# Altium schematic sheet MCU.SchDoc
size A3; SheetNumber: 3; SheetTotal: 6
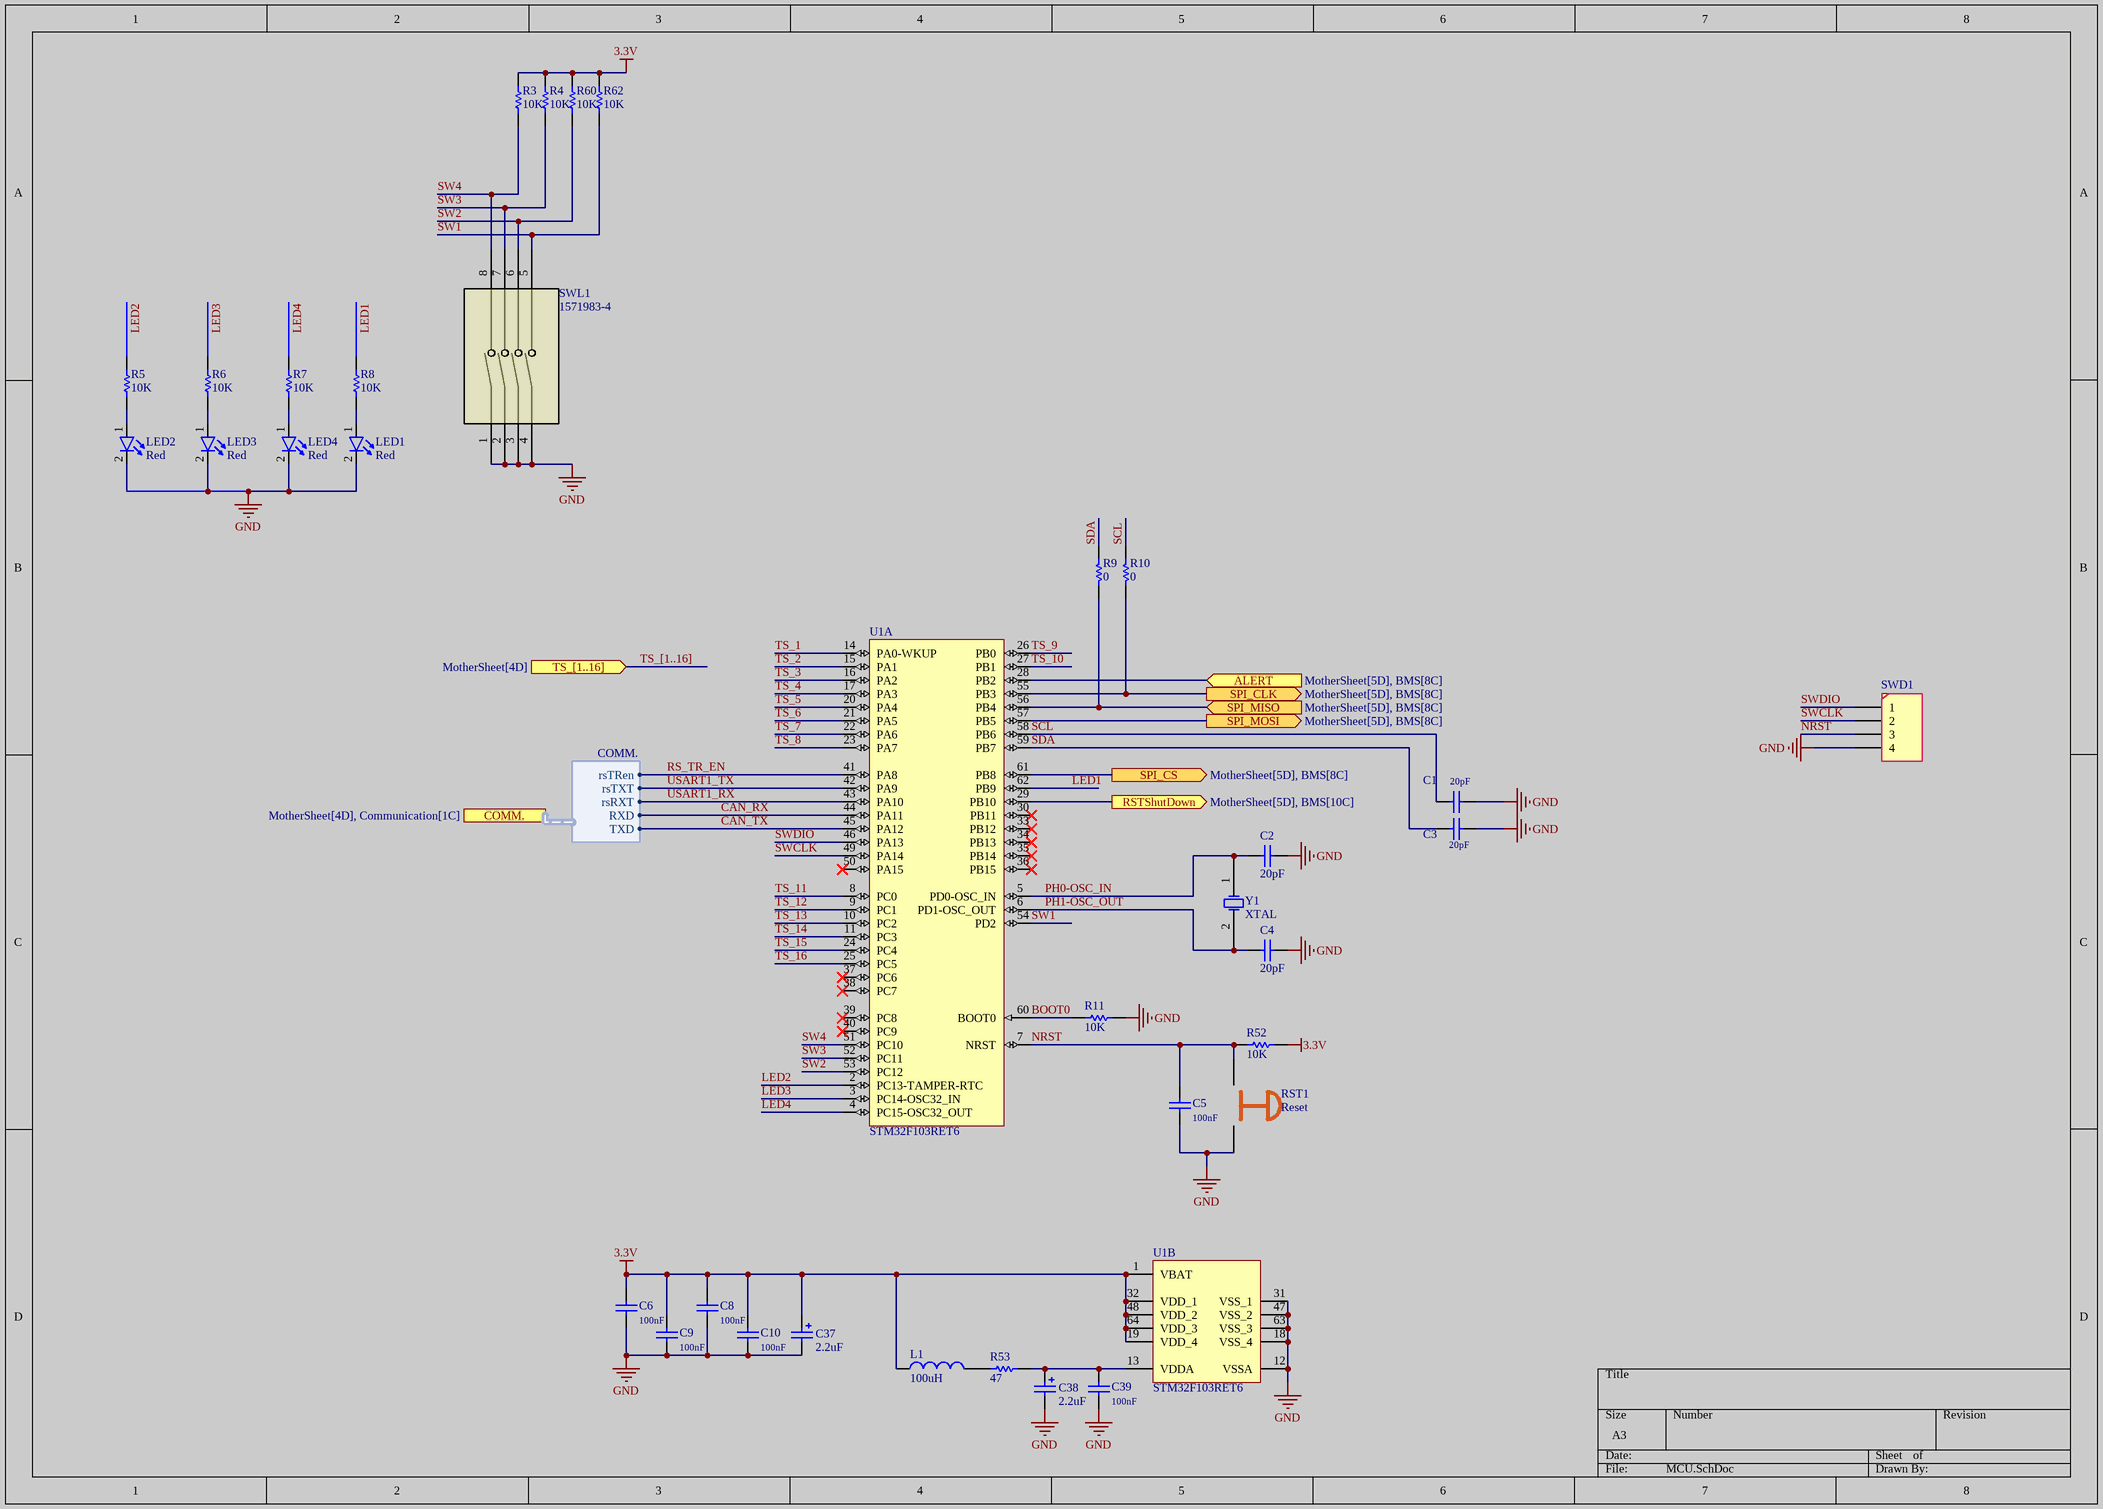
[diagram p0: MCU.SchDoc]

## Parts
C1  20pF  [CAPC0603]
C2  20pF  [CAPC0603]
C3  20pF  [CAPC0603]
C4  20pF  [CAPC0603]
C5  100nF  [CAPC0603]
C6  100nF  [CAPC0603]
C8  100nF  [CAPC0603]
C9  100nF  [CAPC0603]
C10  100nF  [CAPC0603]
C37  2.2uF  [CAP1206]
C38  2.2uF  [CAP1206]
C39  100nF  [CAPC0603]
L1  100uH  [RES1206]
LED1  Red  [LED]
LED2  Red  [LED]
LED3  Red  [LED]
LED4  Red  [LED]
R3  10K  [RES0603]
R4  10K  [RES0603]
R5  10K  [RESC0603]
R6  10K  [RESC0603]
R7  10K  [RESC0603]
R8  10K  [RESC0603]
R9  0  [RESC0603]
R10  0  [RESC0603]
R11  10K  [RESC0603]
R52  10K  [RESC0603]
R53  47  [RESC0603]
R60  10K  [RES0603]
R62  10K  [RES0603]
RST1  Reset  [SWITCH-PB4]
SWD1  (no value)  [PIN HEADER 1*4 MALE]
SWL1  1571983-4  [SW4_1571983_4P_TEC]
U1  STM32F103RET6  [LQFP, 64]  (parts A,B of 2)
Y1  XTAL  [XTAL]

## Ports
ALERT (in, see MotherSheet[5D], BMS[8C]), COMM. (harness COMM., see MotherSheet[4D], Communication[1C]), RSTShutDown (out, see MotherSheet[5D], BMS[10C]), SPI_CLK (out, see MotherSheet[5D], BMS[8C]), SPI_CS (out, see MotherSheet[5D], BMS[8C]), SPI_MISO (in, see MotherSheet[5D], BMS[8C]), SPI_MOSI (out, see MotherSheet[5D], BMS[8C]), TS_[1..16] (in, see MotherSheet[4D])

## Harnesses
COMM.: RXD, TXD, rsRXT, rsTXT, rsTRen

## Nets
3.3V: C6.1 C8.1 C9.1 C10.1 C37.1 L1.1 R3.2 R4.2 R52.2 R60.2 R62.2 U1.1(VBAT) U1.19(VDD_4) U1.32(VDD_1) U1.48(VDD_2) U1.64(VDD_3)
GND: C1.2 C2.1 C3.2 C4.1 C5.2 C6.2 C8.2 C9.2 C10.2 C37.2 C38.2 C39.2 LED1.2(K) LED2.2(K) LED3.2(K) LED4.2(K) R11.1 RST1.2 SWD1.4 SWL1.1 SWL1.2 SWL1.3 SWL1.4 U1.12(VSSA) U1.18(VSS_4) U1.31(VSS_1) U1.47(VSS_2) U1.63(VSS_3)
ALERT: U1.28(PB2) ; port ALERT
BOOT0: R11.2 U1.60(BOOT0)
CAN_RX: U1.44(PA11) ; port COMM..RXD
CAN_TX: U1.45(PA12) ; port COMM..TXD
LED1: R8.2 U1.62(PB9)
LED2: R5.2 U1.2(PC13-TAMPER-RTC)
LED3: R6.2 U1.3(PC14-OSC32_IN)
LED4: R7.2 U1.4(PC15-OSC32_OUT)
NRST: C5.1 R52.1 RST1.1 SWD1.3 U1.7(NRST)
PH0-OSC_IN: C2.2 U1.5(PD0-OSC_IN) Y1.1
PH1-OSC_OUT: C4.2 U1.6(PD1-OSC_OUT) Y1.2
RS_TR_EN: U1.41(PA8) ; port COMM..rsTRen
RSTShutDown: U1.29(PB10) ; port RSTShutDown
SCL: C1.1 R10.1 U1.58(PB6)
SDA: C3.1 R9.1 U1.59(PB7)
SPI_CLK: R10.2 U1.55(PB3) ; port SPI_CLK
SPI_CS: U1.61(PB8) ; port SPI_CS
SPI_MISO: R9.2 U1.56(PB4) ; port SPI_MISO
SPI_MOSI: U1.57(PB5) ; port SPI_MOSI
SW1: R62.1 SWL1.5 U1.54(PD2)
SW2: R60.1 SWL1.6 U1.53(PC12)
SW3: R4.1 SWL1.7 U1.52(PC11)
SW4: R3.1 SWL1.8 U1.51(PC10)
SWCLK: SWD1.2 U1.49(PA14)
SWDIO: SWD1.1 U1.46(PA13)
TS_1: U1.14(PA0-WKUP)
TS_2: U1.15(PA1)
TS_3: U1.16(PA2)
TS_4: U1.17(PA3)
TS_5: U1.20(PA4)
TS_6: U1.21(PA5)
TS_7: U1.22(PA6)
TS_8: U1.23(PA7)
TS_9: U1.26(PB0)
TS_10: U1.27(PB1)
TS_11: U1.8(PC0)
TS_12: U1.9(PC1)
TS_13: U1.10(PC2)
TS_14: U1.11(PC3)
TS_15: U1.24(PC4)
TS_16: U1.25(PC5)
USART1_RX: U1.43(PA10) ; port COMM..rsRXT
USART1_TX: U1.42(PA9) ; port COMM..rsTXT
NetC38_1: C38.1 C39.1 R53.1 U1.13(VDDA)
NetL1_2: L1.2 R53.2
NetLED1_1: LED1.1(A) R8.1
NetLED2_1: LED2.1(A) R5.1
NetLED3_1: LED3.1(A) R6.1
NetLED4_1: LED4.1(A) R7.1

Not connected (* = marked no-connect by the designer): U1 30(PB11)* 33(PB12)* 34(PB13)* 35(PB14)* 36(PB15)* 37(PC6)* 38(PC7)* 39(PC8)* 40(PC9)* 50(PA15)*

## Buses and harness runs
bus TS_[1..16] = port TS_[1..16]

## Library data of the parts
C1-C6 C8-C10 C39 = Capacitor: Published: 8-Jun-2000; LatestRevisionDate: 17-Jul-2002; LatestRevisionNote: Re-released for DXP Platform.; PackageReference: C0805; Publisher: Altium Limited
  C1-C4: Value: 20pF
  C5 C6 C8-C10 C39: Value: 100nF
C37 C38 = Cap_Tan: Tantalium Capacitor Size C; Published: 8-Jun-2000; LatestRevisionDate: 17-Jul-2002; LatestRevisionNote: Re-released for DXP Platform.; PackageReference: C0805; Publisher: Altium Limited
L1 = INDUCTOR: Value: 68uH; Code_IEC: 1005; Published: 8-Jun-2000; Publisher: Altium Limited; LatestRevisionDate: 17-Jul-2002; LatestRevisionNote: Re-released for DXP Platform.; PackageReference: 0402-A; Code_JEITA: 0402
LED1-LED4 = LED: Designer: Saeid Jorablo; Organazation: ControTec; Adding Date: 1387/12/22; Color: Red; Size: SMD 0603
R3-R11 R52 R53 R60 R62 = Resistor: 0603,0.1W; Published: 8-Jun-2000; LatestRevisionDate: 17-Jul-2002; LatestRevisionNote: Re-released for DXP Platform.; PackageReference: AXIAL-0.5; Publisher: Altium Limited
  R3-R8 R11 R52 R60 R62: Value: 10K
  R9 R10: Value: 0
  R53: Value: 47
RST1 = Swtich-PB4: 4-Pin Push Button
SWD1 = Header1*4: Header, 4-Pin
SWL1 = 1571983-4: GDH04S04=DIP SWITCH; Manufacturer_Name: TE Connectivity; Copyright: Copyright (C) 2025 Ultra Librarian. All rights reserved.; Manufacturer_Part_Number: 1571983-4; RefDes: RefDes; Type: Type
U1 = STM32F103RET6: ARM Cortex-M3 32-bit MCU, 512 KB Flash, 64 KB Internal RAM, 51 I/Os, 64-pin LQFP, -40 to 85 degC, Tray; A/D Converter: 3x12-bit (16 Channel); D/A Converter: 2x12-bit (2 Channel); FLASH Size (Prog) (kB): 512; I/Os (High Current): 51; Internal RAM Size (kB): 64; Operating Frequency(F) (Processor speed) (MHz): 72; Supply Voltage(Vcc) min (V): 2; DatasheetVersion: Rev. 8; PackageVersion: Rev. 4, 06/2013; PackageReference: LQFP64; PackageDescription: 64-Pin Low Profile Quad Flat Package, 10 x 10 mm Body, 0.5 mm Pitch; Supplier 1: Digi-Key; Supplier Part Number 1: 497-6444-ND; Supplier 2: Farnell; Supplier Part Number 2: 1624138; Supplier 3: Newark; Supplier Part Number 3: 01P4101; Supplier 4: Newark; Supplier Part Number 4: 57P1231; Supplier 5: Mouser; Supplier Part Number 5: 511-STM32F103RET6; Core: ARM Cortex-M3; Packing: Tray; Mounting Technology: Surface Mount; PartNumber: STM32F103RET6; ComponentLink1Description: Manufacturer URL; ComponentLink1URL: http://www.st.com/web/en/home.html; ComponentLink2Description: Datasheet; ComponentLink2URL: http://www.st.com/st-web-ui/static/active/en/resource/technical/document/datasheet/CD00191185.pdf; ComponentLink3Description: Package Specification; ComponentLink3URL: http://www.st.com/st-web-ui/static/active/en/resource/technical/document/datasheet/DM00037051.pdf